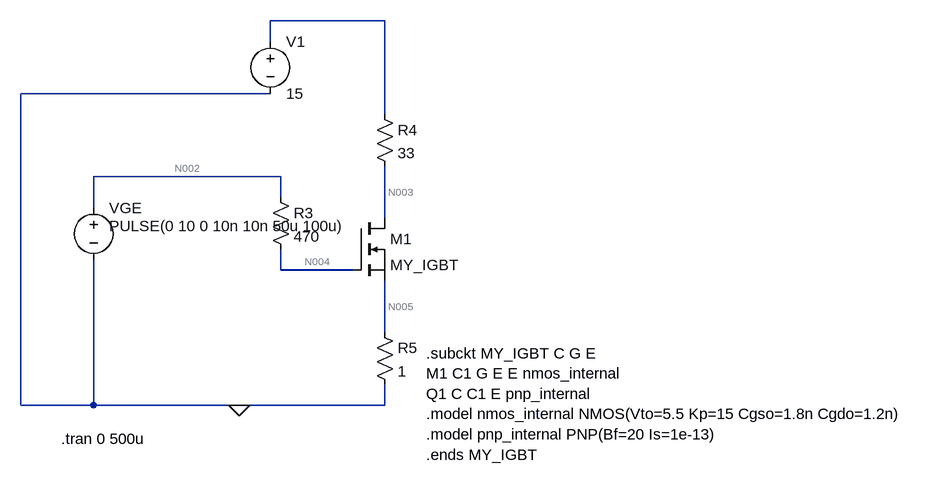
[diagram p0: schematic Draft2.asc]
Draft2.asc, the LTspice schematic file:
Version 4
SHEET 1 880 680
WIRE -592 -64 -768 -64
WIRE -768 -32 -768 -64
WIRE -768 48 -1152 48
WIRE -592 80 -592 -64
WIRE -752 176 -1040 176
WIRE -752 208 -752 176
WIRE -1040 224 -1040 176
WIRE -592 240 -592 160
WIRE -752 320 -752 288
WIRE -640 320 -752 320
WIRE -592 416 -592 336
WIRE -1152 528 -1152 48
WIRE -1040 528 -1040 304
WIRE -1040 528 -1152 528
WIRE -816 528 -1040 528
WIRE -592 528 -592 496
WIRE -592 528 -816 528
FLAG -816 528 0
SYMBOL voltage -768 -48 R0
SYMATTR InstName V1
SYMATTR Value 15
SYMBOL res -768 192 R0
SYMATTR InstName R3
SYMATTR Value 470
SYMBOL nmos -640 240 R0
SYMATTR InstName M1
SYMATTR Value MY_IGBT
SYMATTR Prefix X
SYMBOL res -608 64 R0
SYMATTR InstName R4
SYMATTR Value 33
SYMBOL res -608 400 R0
SYMATTR InstName R5
SYMATTR Value 1
SYMBOL voltage -1040 208 R0
WINDOW 3 24 44 Left 2
WINDOW 123 0 0 Left 0
WINDOW 39 0 0 Left 0
SYMATTR InstName VGE
SYMATTR Value PULSE(0 10 0 10n 10n 50u 100u)
TEXT -1090 580 Left 2 !.tran 0 500u
TEXT -528 448 Left 2 !.subckt MY_IGBT C G E\nM1 C1 G E E nmos_internal\nQ1 C C1 E pnp_internal\n.model nmos_internal NMOS(Vto=5.5 Kp=15 Cgso=1.8n Cgdo=1.2n)\n.model pnp_internal PNP(Bf=20 Is=1e-13)\n.ends MY_IGBT

The netlist it stands for:
* Draft2.asc
V1 N001 0 15
R3 N002 N004 470
XM1 N003 N004 N005 MY_IGBT  ; pins D G S
R4 N001 N003 33
R5 N005 0 1
VGE N002 0 PULSE(0 10 0 10n 10n 50u 100u)
.tran 0 500u
.subckt MY_IGBT C G E
M1 C1 G E E nmos_internal
Q1 C C1 E pnp_internal
.model nmos_internal NMOS(Vto=5.5 Kp=15 Cgso=1.8n Cgdo=1.2n)
.model pnp_internal PNP(Bf=20 Is=1e-13)
.ends MY_IGBT
.backanno
.end

* Results of the author's LTspice run, read from the files saved beside the schematic
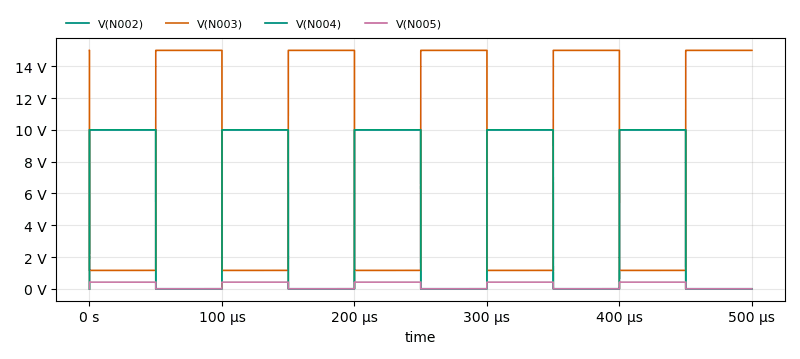
[diagram p1: Transient Analysis of Draft2.asc, plotted from the saved traces]
* Transient Analysis, 1 run:
*   V(N002): min 0 V, max 10 V, average 5.001 V, rms 7.072 V, last 0 V
*   V(N003): min 1.157 V, max 15 V, average 8.077 V, rms 10.64 V, last 15 V
*   V(N004): min -8.994 µV, max 10 V, average 5.001 V, rms 7.072 V, last 0 V
*   V(N005): min -169.6 µV, max 420.2 mV, average 209.8 mV, rms 296.6 mV, last 0 V